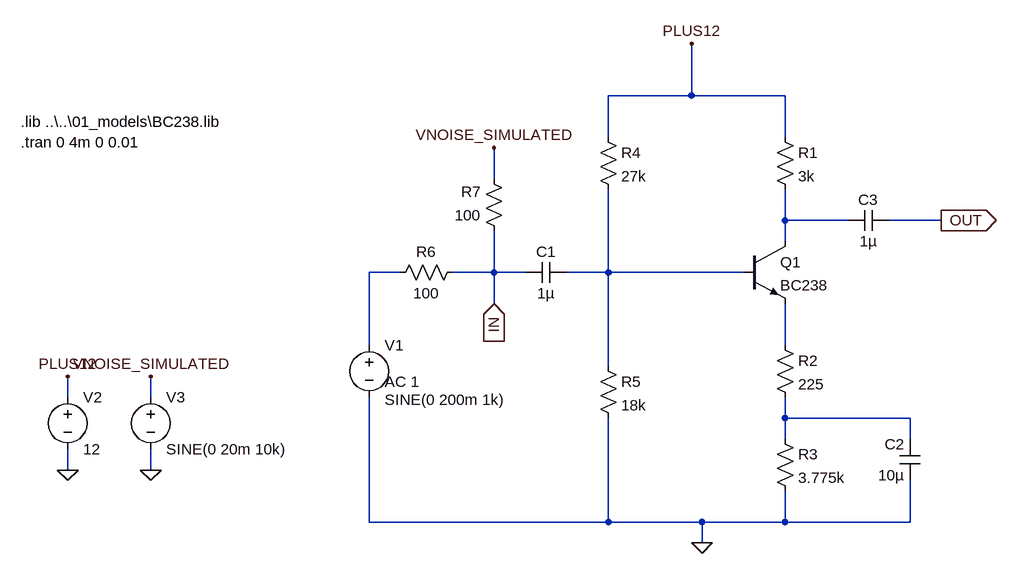
[diagram p0: schematic 01_common_emitter_20201213_2225.asc]
01_common_emitter_20201213_2225.asc, the LTspice schematic file:
Version 4
SHEET 1 1216 680
WIRE 528 -112 528 -192
WIRE 528 -112 400 -112
WIRE 672 -112 528 -112
WIRE 400 -48 400 -112
WIRE 672 -48 672 -112
WIRE 224 16 224 -32
WIRE 672 80 672 32
WIRE 768 80 672 80
WIRE 912 80 832 80
WIRE 672 112 672 80
WIRE 80 160 32 160
WIRE 224 160 224 96
WIRE 224 160 160 160
WIRE 272 160 224 160
WIRE 400 160 400 32
WIRE 400 160 336 160
WIRE 608 160 400 160
WIRE 224 208 224 160
WIRE 32 272 32 160
WIRE 672 272 672 208
WIRE 400 304 400 160
WIRE -432 352 -432 320
WIRE -304 352 -304 320
WIRE 672 384 672 352
WIRE 864 384 672 384
WIRE 672 416 672 384
WIRE 864 416 864 384
WIRE -432 464 -432 432
WIRE -304 464 -304 432
WIRE 32 544 32 352
WIRE 400 544 400 384
WIRE 400 544 32 544
WIRE 544 544 400 544
WIRE 672 544 672 496
WIRE 672 544 544 544
WIRE 864 544 864 480
WIRE 864 544 672 544
WIRE 544 576 544 544
FLAG 544 576 0
FLAG -304 464 0
FLAG -432 320 PLUS12
FLAG 528 -192 PLUS12
FLAG 224 208 IN
IOPIN 224 208 In
FLAG 912 80 OUT
IOPIN 912 80 Out
FLAG -432 464 0
FLAG -304 320 VNOISE_SIMULATED
FLAG 224 -32 VNOISE_SIMULATED
SYMBOL res 656 -64 R0
SYMATTR InstName R1
SYMATTR Value 3k
SYMBOL res 656 256 R0
SYMATTR InstName R2
SYMATTR Value 225
SYMBOL res 384 -64 R0
SYMATTR InstName R4
SYMATTR Value 27k
SYMBOL res 384 288 R0
SYMATTR InstName R5
SYMATTR Value 18k
SYMBOL cap 336 144 R90
WINDOW 0 0 32 VBottom 2
WINDOW 3 32 32 VTop 2
SYMATTR InstName C1
SYMATTR Value 1µ
SYMBOL cap 832 64 R90
WINDOW 0 0 32 VBottom 2
WINDOW 3 32 32 VTop 2
SYMATTR InstName C3
SYMATTR Value 1µ
SYMBOL voltage 32 256 R0
WINDOW 3 24 100 Left 2
WINDOW 123 24 72 Left 2
WINDOW 39 0 0 Left 2
SYMATTR Value SINE(0 200m 1k)
SYMATTR Value2 AC 1
SYMATTR InstName V1
SYMBOL voltage -432 336 R0
WINDOW 123 0 0 Left 2
WINDOW 39 0 0 Left 2
SYMATTR InstName V2
SYMATTR Value 12
SYMBOL res 656 400 R0
SYMATTR InstName R3
SYMATTR Value 3.775k
SYMBOL cap 880 480 R180
WINDOW 0 24 56 Left 2
WINDOW 3 24 8 Left 2
SYMATTR InstName C2
SYMATTR Value 10µ
SYMBOL voltage -304 336 R0
WINDOW 123 0 0 Left 0
WINDOW 39 0 0 Left 0
SYMATTR InstName V3
SYMATTR Value SINE(0 20m 10k)
SYMBOL npn 608 112 R0
SYMATTR InstName Q1
SYMATTR Value BC238
SYMBOL res 176 144 R90
WINDOW 0 0 56 VBottom 2
WINDOW 3 32 56 VTop 2
SYMATTR InstName R6
SYMATTR Value 100
SYMBOL res 240 112 R180
WINDOW 0 36 76 Left 2
WINDOW 3 36 40 Left 2
SYMATTR InstName R7
SYMATTR Value 100
TEXT -504 -40 Left 2 !.tran 0 4m 0 0.01
TEXT -504 -72 Left 2 !.lib ..\\..\\01_models\\BC238.lib

The netlist it stands for:
* 01_common_emitter_20201213_2225.asc
R1 PLUS12 N001 3k
R2 N004 N005 225
R4 PLUS12 N003 27k
R5 N003 0 18k
C1 N003 IN 1µ
C3 OUT N001 1µ
V1 N002 0 SINE(0 200m 1k) AC 1
V2 PLUS12 0 12
R3 N005 0 3.775k
C2 0 N005 10µ
V3 VNOISE_SIMULATED 0 SINE(0 20m 10k)
Q1 N001 N003 N004 0 BC238
R6 IN N002 100
R7 IN VNOISE_SIMULATED 100
.model NPN NPN
.model PNP PNP
.lib standard.bjt
.tran 0 4m 0 0.01
.lib ..\..\01_models\BC238.lib
.backanno
.end